# Altium project Power_Block.PrjPcb
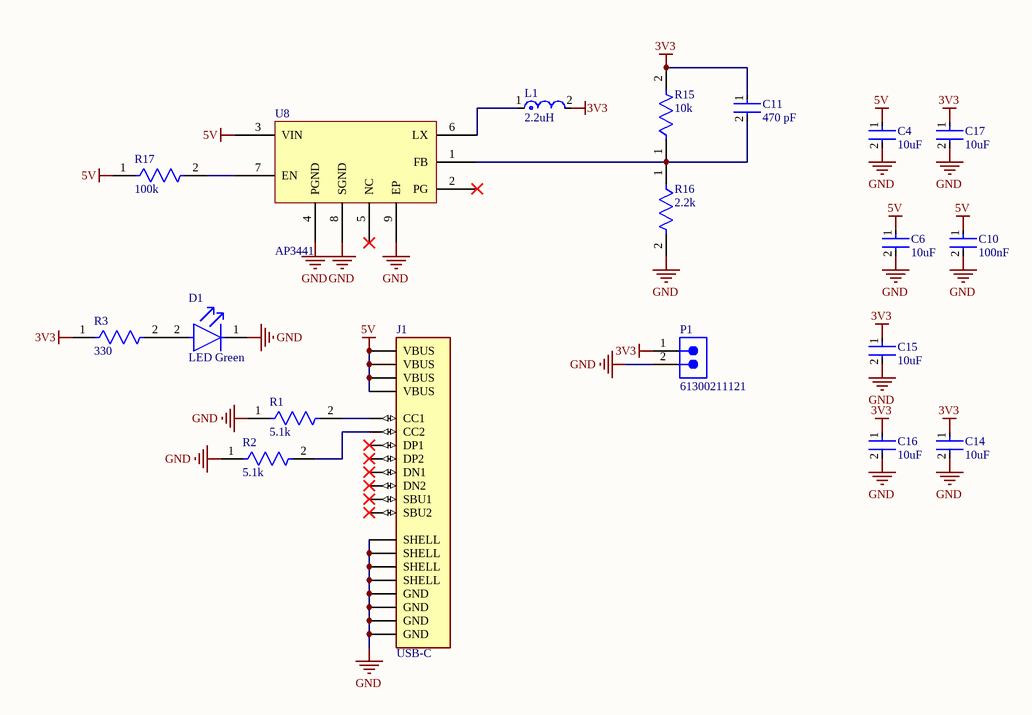
[diagram p0: PowerBlock.SchDoc]
1 sheet, 19 parts. Net scope: global (net labels, ports and power ports of the same name join across sheets).
Board file: PowerBlock.PcbDoc

## Sheet PowerBlock.SchDoc
size A; SheetNumber: 1; SheetTotal: 1

### Parts
C4  10uF  [FP-C0805C106K3PACTU-MFG]
C6  10uF  [FP-C0805C106K3PACTU-MFG]
C10  100nF  [FP-C0805C106K3PACTU-MFG]
C11  470 pF  [FP-C0805C106K3PACTU-MFG]
C14  10uF  [FP-C0805C106K3PACTU-MFG]
C15  10uF  [FP-C0805C106K3PACTU-MFG]
C16  10uF  [FP-C0805C106K3PACTU-MFG]
C17  10uF  [FP-C0805C106K3PACTU-MFG]
D1  LED Green  [FP-LTST-C171KGKT-MFG]
J1  USB-C  [GCT_USB4085-GF-A_REVA4]
L1  2.2uH  [FP-XAL4020-MFG]
P1  61300211121  [61300211121]
R1  5.1k  [FP-CRGP0805-IPC_C]
R2  5.1k  [FP-CRGP0805-IPC_C]
R3  330  [FP-CRGP0805-IPC_C]
R15  10k  [FP-CRGP0805-IPC_C]
R16  2.2k  [FP-CRGP0805-IPC_C]
R17  100k  [FP-CRGP0805-IPC_C]
U8  AP3441  [SON50P201X201X60-9M]

### Nets
3V3: C11.1 C14.1 C15.1 C16.1 C17.1 L1.2 P1.1 R3.1 R15.2
5V: C4.1 C6.1 C10.1 J1.A4(VBUS) J1.A9(VBUS) J1.B4(VBUS) J1.B9(VBUS) R17.1 U8.3(VIN)
GND: C4.2 C6.2 C10.2 C14.2 C15.2 C16.2 C17.2 D1.1(C) J1.A1(GND) J1.A12(GND) J1.B1(GND) J1.B12(GND) J1.S1(SHELL) J1.S2(SHELL) J1.S3(SHELL) J1.S4(SHELL) P1.2 R1.1 R2.1 R16.2 U8.4(PGND) U8.8(SGND) U8.9(EP)
NetC11_2: C11.2 R15.1 R16.1 U8.1(FB)
NetD1_2: D1.2(A) R3.2
NetJ1_A5: J1.A5(CC1) R1.2
NetJ1_B5: J1.B5(CC2) R2.2
NetL1_1: L1.1 U8.6(LX)
NetR17_2: R17.2 U8.7(EN)

Not connected (* = marked no-connect by the designer): J1 A6(DP1)* A7(DN1)* A8(SBU1)* B6(DP2)* B7(DN2)* B8(SBU2)*; U8 2(PG)* 5(NC)*

### Library data of the parts
C4 C6 C10 C11 C14-C17 = CMP-03020-034663-1: CAP CER 10UF 25V X5R 0805; Dissipation Factor: 10%; Dielectric Material: Ceramic; RoHS Compliant: Yes; Voltage Rating: 25V; Case Code (Metric): 2012; Case Code (Imperial): 0805; Capacitance: 10uF; Lead Free: Lead Free; Dielectric: X5R; Depth: 1.25mm; Case/Package: 0805; Height: 1.25mm; Length: 0.079inch; Termination: Solder; Thickness: 0.057inch; Tolerance: 10%; Min Operating Temperature: -55°C; Width: 0.049inch; Mount: Surface Mount; Voltage Rating (DC): 25V; REACH SVHC: No SVHC; Voltage: 25V; Packaging: Cut Tape; Max Operating Temperature: 85°C
D1 = CMP-22017-000037-1: LED GREEN CLEAR SMD; Number of LEDs: 1; Viewing Angle: 130°; Lens Style: Rectangular; Dominant Wavelength: 571nm; Test Current: 20mA; Luminous Intensity: 35mcd; Power Rating: 75mW; Forward Voltage: 2.4V; Forward Current: 30mA; Reverse Voltage: 5V; Lens Color: Colorless; Wavelength: 574nm; Height: 0.8mm; Illumination Color: Green; Length: 2mm; Case/Package: 0805; Number of Pins: 2; Number of Elements: 1; Package Quantity: 1; Depth: 1.25mm; Lens Transparency: Clear; Width: 1.25mm; Color: Green; Radiation Hardening: No; Mount: Surface Mount; Packaging: Tape and Reel; Case Code (Metric): 2012; Lead Free: Lead Free; Max Operating Temperature: 85°C; Min Operating Temperature: -55°C; Case Code (Imperial): 0805; Power Dissipation: 75mW
J1 = USB4085-GF-A_REVA4: USB-C (USB TYPE-C) USB 2.0 Receptacle Connector 24 (16+8 Dummy) Position Through Hole, Right Angle, low cost, 3.46mm profile, 16 pin, horizontal, Top mount; MF: Global Connector Technology; SnapEDA_Link: https://www.snapeda.com/parts/USB4085-GF-A/Global+Connector+Technology/view-part/?ref=snap; Package: None; MP: USB4085-GF-A; Check_prices: https://www.snapeda.com/parts/USB4085-GF-A/Global+Connector+Technology/view-part/?ref=eda; Purchase-URL: https://pricing.snapeda.com/search/part/USB4085-GF-A/?ref=eda; Price: None; Value: *; Availability: In Stock
L1 = CMP-11268-000134-1: Fixed Inductors 2.2uH Shld 20% 5.5A 38.7mOhms AECQ2; Saturation Current: 5.6A; Core Material: Composite; DC Resistance (DCR): 38.7mR; Self Resonant Frequency: 52MHz; Test Frequency: 100kHz; Shielding: Shielded; Length: 4.3mm; Tolerance: 20%; Packaging: Tape and Reel; Height: 2.1mm; Mount: Surface Mount; Termination: SMD/SMT; Lead Free: Contains Lead; Package Quantity: 1000; Inductance: 2.2uH; Series: XAL4020; Min Operating Temperature: -40°C; Max DC Current: 5.5A; Max Operating Temperature: 125°C; Case/Package: SMD/SMT; Inductance Tolerance: 20%; RMS Current (Irms): 5.5A; Width: 4.3mm; RoHS Compliant: Yes
P1 = CMP-1712-00002-7: THT Vertical Pin Header WR-PHD, Pitch 2.54 mm, Single Row, 2 pins; Pitch: 2.54mm; Number of Contacts: 2; Connector Type: Male Pin; Gender: Male; Contact Resistance: 20mΩ; Operating Supply Voltage: 250V; Current Rating: 3A; Housing Material: PBT; RoHS: Compliant; Lead Free: Lead Free; Contact Material: Gold; REACH SVHC: No; Min Operating Temperature: -40°C; Termination: Through Hole; Number of Pins: 2; Contact Gender: Male; Packaging: Bulk; Lead Pitch: 2.54mm; Contact Plating: Gold; Orientation: Vertical; Mount: Through Hole; Height: 8.94mm; Color: Black; Number of Positions: 2; Contact Mating Length: 5.9944mm; Max Operating Temperature: 105°C; Voltage Rating: 250V; Number of Rows: 1
R1-R3 R15-R17 = CMP-03211-006861-1: CRGP 0805 10K 1%; Manufacturer Part Number: CRGP0805F10K; Manufacturer: TE; Power Rating: 0.33W; Voltage Rating: 150V; Value: 10KΩ; Tolerance: 0.01; Temperature Coefficient: ±100ppm/°C; ComponentLink2URL: https://www.mouser.com/datasheet/2/418/NG_DS_9-1773463-9_A-1358566.pdf; Temperature Range Low: -55°C; Ipc Land Pattern Name: RESC200125X55; Device Class L2: Resistors; Automotive: No; Device Class L3: Chip SMD Resistors; Composition: Thick Film; Temperature Range High: +155°C; Temperature: -55°C to +155°C; Height: 0.65mm; Series: CRGP; RoHS: TRUE; Device Class L1: Passive Components; Octopart: https://octopart.com/crgp0805f10k-te+connectivity-91018782; Package: CRGP0805; Digikey Description: CRGP 0805 10K 1%; Ambient Temperature Range High: +70°C; Lead Free: Yes; ComponentLink2Description: Datasheet; Category: Res; Resistance: 10KΩ
U8 = AP3441LSHE-7B: DC-DC Switching Buck Regulator, Adjustable, 2.7 to 5.5 V in, 0.6 to 5.5 V/3 A, U-DFN2020-8; Manufacturer: Diodes Inc.; Manufacturer Package Identifier: U-DFN2020-8 (Type E); Max Duty Cycle: 100%; Max Supply Voltage: 5.5V; Max Junction Temperature (Tj): 125°C; Max Power Dissipation: 1.4W; Max Switching Frequency: 1.2MHz; Min Input Voltage: 2.7V; Min Output Voltage: 600mV; Nominal Supply Voltage: 5V; Nominal Output Voltage: 2.5V; Nominal Supply Current: 55µA; Number of Circuits: 1; Output Current: 3A; Switching Frequency: 1MHz; Supplier: Newark; Supplier Part Number: AP3441LSHE-7B; Manufacturer Part Number: AP3441LSHE-7B; RoHS: Compliant; Category: Voltage Regulators - Switching; Pricing: 5=0.314, 15=0.217, 25=0.193 (USD); Ambient Temperature Range High: 85°C; China RoHS: Compliant; Height: 600µm; Height - Seated (Max): 600µm; Length: 2mm; Lifecycle Status: Production; Max Operating Temperature: 85°C; Max Output Voltage: 5.5V; Min Operating Temperature: -40°C; Min Supply Voltage: 2.7V; Nominal Supply Voltage (DC): 5V; Number of Outputs: 1; Number of Terminals: 8; REACH SVHC: Yes; Terminal Pitch: 500µm; Topology: Buck; Width: 2mm; ComponentLink1URL: https://datasheet.octopart.com:443/AP3441LSHE-7B-Diodes-Inc.-datasheet-151209809.pdf?src-supplier=IHS; ComponentLink1Description: https://datasheet.octopart.com:443/AP3441LSHE-7B-Diodes-Inc.-datasheet-151209809.pdf?src-supplier=IHS; ComponentLink2URL: https://sigma.octopart.com:443/151209808/technical_drawing/Diodes-Inc.-AP3441LSHE-7B.pdf?src-supplier=Upverter; ComponentLink2Description: https://sigma.octopart.com:443/151209808/technical_drawing/Diodes-Inc.-AP3441LSHE-7B.pdf?src-supplier=Upverter